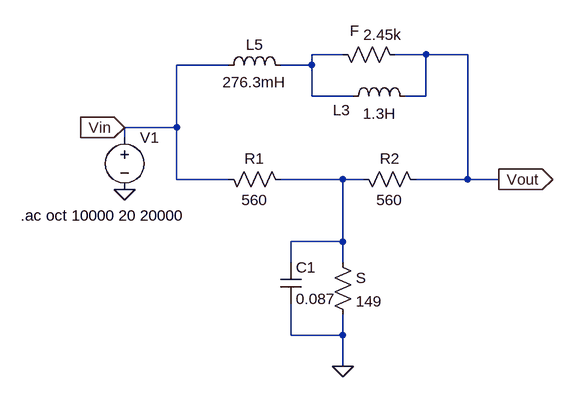
[diagram p0: schematic HiCutLoBoost.asc]
HiCutLoBoost.asc, the LTspice schematic file:
Version 4
SHEET 1 900 680
WIRE 496 176 448 176
WIRE 624 176 576 176
WIRE 688 176 624 176
WIRE 320 192 240 192
WIRE 448 192 448 176
WIRE 448 192 400 192
WIRE 448 240 448 192
WIRE 512 240 448 240
WIRE 624 240 624 176
WIRE 624 240 592 240
WIRE 240 288 240 192
WIRE 240 288 160 288
WIRE 160 304 160 288
WIRE 240 368 240 288
WIRE 320 368 240 368
WIRE 496 368 400 368
WIRE 528 368 496 368
WIRE 688 368 688 176
WIRE 688 368 608 368
WIRE 736 368 688 368
WIRE 496 464 496 368
WIRE 496 464 416 464
WIRE 416 496 416 464
WIRE 496 496 496 464
WIRE 416 608 416 560
WIRE 496 608 496 576
WIRE 496 608 416 608
WIRE 496 656 496 608
FLAG 496 656 0
FLAG 736 368 Vout
IOPIN 736 368 Out
FLAG 160 288 Vin
IOPIN 160 288 In
FLAG 160 384 0
SYMBOL ind 416 208 M270
WINDOW 0 32 56 VTop 2
WINDOW 3 5 56 VBottom 2
SYMATTR InstName L5
SYMATTR Value 276.3mH
SYMATTR SpiceLine Rser=51.7
SYMBOL ind 608 256 M270
WINDOW 0 -21 114 VTop 2
WINDOW 3 5 56 VBottom 2
SYMATTR InstName L3
SYMATTR Value 1.3H
SYMATTR SpiceLine Rser=233
SYMBOL Res 416 384 M270
WINDOW 0 32 56 VTop 2
WINDOW 3 0 56 VBottom 2
SYMATTR InstName R1
SYMATTR Value 560
SYMBOL Res 624 384 M270
WINDOW 0 32 56 VTop 2
WINDOW 3 0 56 VBottom 2
SYMATTR InstName R2
SYMATTR Value 560
SYMBOL Cap 400 496 R0
SYMATTR InstName C1
SYMATTR Value 0.087
SYMBOL Res 480 480 R0
SYMATTR InstName S
SYMATTR Value 149
SYMBOL Res 592 192 M270
WINDOW 0 37 78 VTop 2
WINDOW 3 62 35 VBottom 2
SYMATTR InstName F
SYMATTR Value 2.45k
SYMBOL Voltage 160 288 R0
SYMATTR InstName V1
SYMATTR Value ""
SYMATTR Value2 AC 1
TEXT 0 424 Left 2 !.ac oct 10000 20 20000

The netlist it stands for:
* HiCutLoBoost.asc
L5 N001 Vin 276.3mH Rser=51.7
L3 Vout N001 1.3H Rser=233
R1 N002 Vin 560
R2 Vout N002 560
C1 N002 0 0.087
R§S N002 0 149
R§F Vout N001 2.45k
V1 Vin 0 AC 1
.ac oct 10000 20 20000
.backanno
.end